# Altium schematic sheet 2_Periph.SchDoc: Peripherals
size A3; SheetNumber: 2
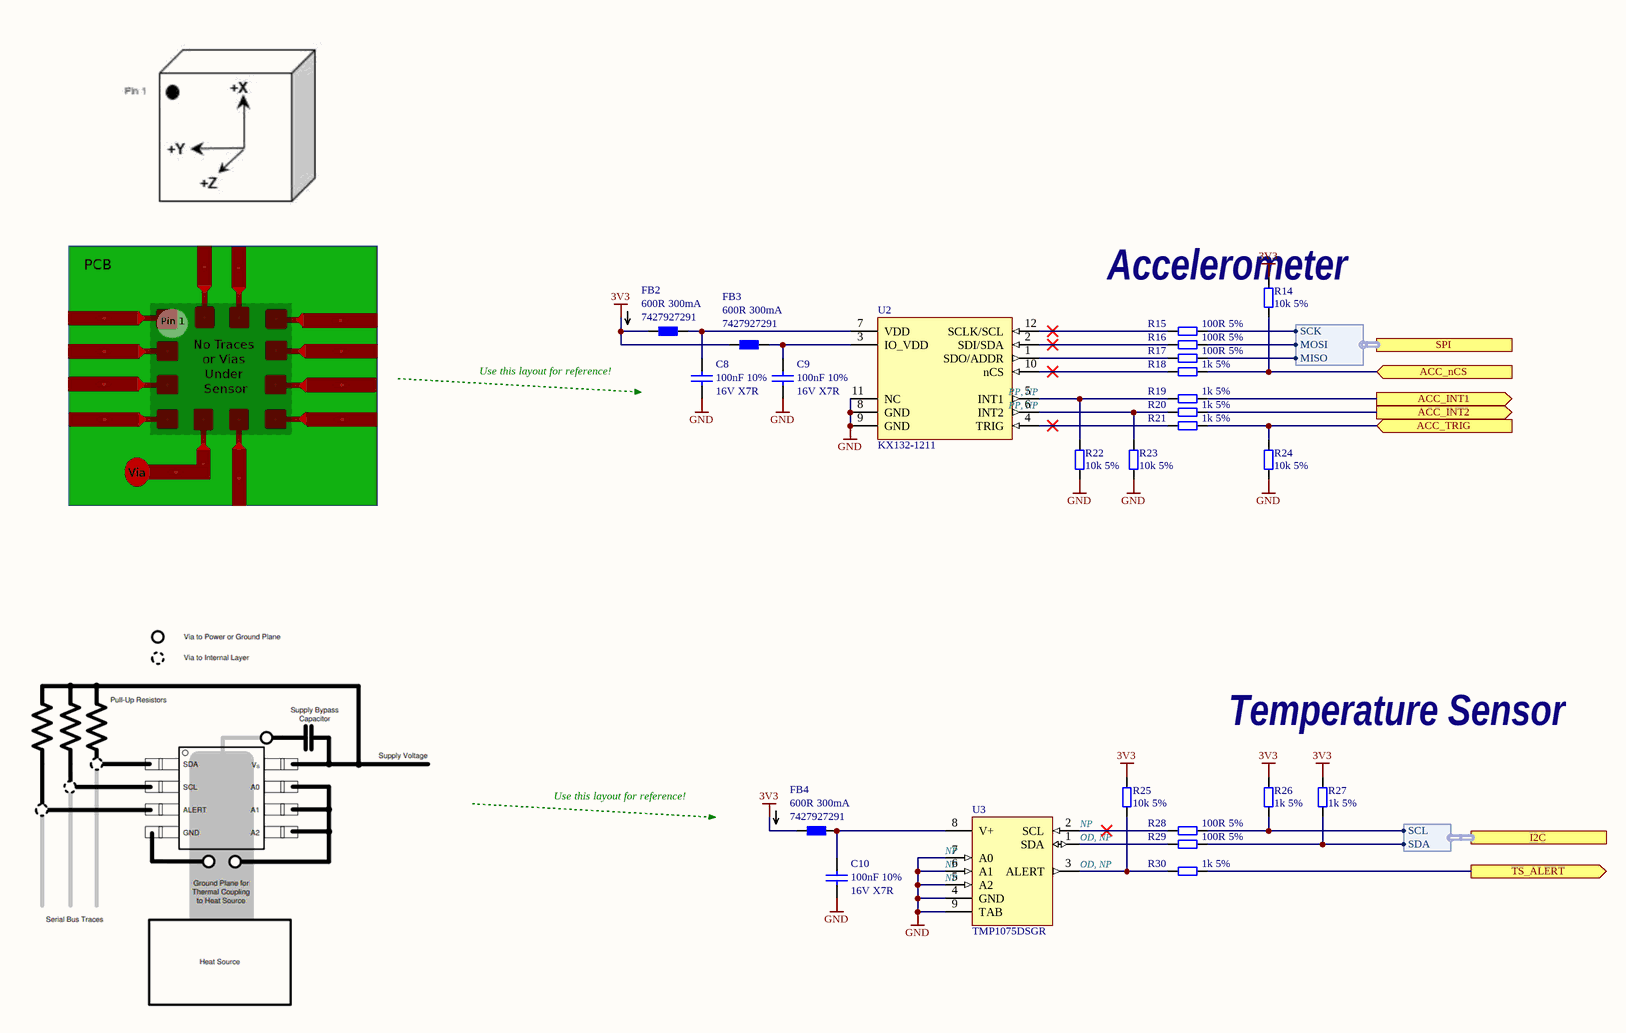
[diagram p0: 2_Periph.SchDoc]

## Parts
C8  Param 2: 16V X7R  Param 1: 100nF 10%  [CAP_0402_L]  (hidden comment: CC0402KRX7R7BB104)
C9  Param 2: 16V X7R  Param 1: 100nF 10%  [CAP_0402_L]  (hidden comment: CC0402KRX7R7BB104)
C10  Param 2: 16V X7R  Param 1: 100nF 10%  [CAP_0402_L]  (hidden comment: CC0402KRX7R7BB104)
FB2  Param 1: 600R 300mA  [BEAD_0402_L]  (hidden comment: 7427927291)
FB3  Param 1: 600R 300mA  [BEAD_0402_L]  (hidden comment: 7427927291)
FB4  Param 1: 600R 300mA  [BEAD_0402_L]  (hidden comment: 7427927291)
R14  Param 1: 10k 5%  [RES_0402_L]  (hidden comment: RC0402JR-0710KL)
R15  Param 1: 100R 5%  [RES_0402_L]  (hidden comment: RC0402JR-07100RL)
R16  Param 1: 100R 5%  [RES_0402_L]  (hidden comment: RC0402JR-07100RL)
R17  Param 1: 100R 5%  [RES_0402_L]  (hidden comment: RC0402JR-07100RL)
R18  Param 1: 1k 5%  [RES_0402_L]  (hidden comment: RC0402JR-071KL)
R19  Param 1: 1k 5%  [RES_0402_L]  (hidden comment: RC0402JR-071KL)
R20  Param 1: 1k 5%  [RES_0402_L]  (hidden comment: RC0402JR-071KL)
R21  Param 1: 1k 5%  [RES_0402_L]  (hidden comment: RC0402JR-071KL)
R22  Param 1: 10k 5%  [RES_0402_L]  (hidden comment: RC0402JR-0710KL)
R23  Param 1: 10k 5%  [RES_0402_L]  (hidden comment: RC0402JR-0710KL)
R24  Param 1: 10k 5%  [RES_0402_L]  (hidden comment: RC0402JR-0710KL)
R25  Param 1: 10k 5%  [RES_0402_L]  (hidden comment: RC0402JR-0710KL)
R26  Param 1: 1k 5%  [RES_0402_L]  (hidden comment: RC0402JR-071KL)
R27  Param 1: 1k 5%  [RES_0402_L]  (hidden comment: RC0402JR-071KL)
R28  Param 1: 100R 5%  [RES_0402_L]  (hidden comment: RC0402JR-07100RL)
R29  Param 1: 100R 5%  [RES_0402_L]  (hidden comment: RC0402JR-07100RL)
R30  Param 1: 1k 5%  [RES_0402_L]  (hidden comment: RC0402JR-071KL)
U2  KX132-1211  [PQFN12P50_200X200]
U3  TMP1075DSGR  [SON9P50_200X200T160X90]

## Ports
ACC_INT1 (out), ACC_INT2 (out), ACC_nCS (in), ACC_TRIG (in), I2C (harness I2C), SPI (harness SPI), TS_ALERT (out)

## Harnesses
SPI: SCK, MOSI, MISO
I2C: SCL, SDA

## Nets
3V3: FB2.2 FB3.2 FB4.2 R14.1 R25.1 R26.1 R27.1
GND: C8.2 C9.2 C10.2 R22.2 R23.2 R24.2 U2.8(GND) U2.9(GND) U2.11(NC) U3.4(GND) U3.5(A2) U3.6(A1) U3.7(A0) U3.9(TAB)
ACC_INT1: R19.2 ; port ACC_INT1
ACC_INT2: R20.2 ; port ACC_INT2
ACC_nCS: R14.2 R18.2 ; port ACC_nCS
ACC_TRIG: R21.2 R24.1 ; port ACC_TRIG
TS_ALERT: R30.2 ; port TS_ALERT
NetC8_1: C8.1 FB2.1 U2.7(VDD)
NetC9_1: C9.1 FB3.1 U2.3(IO_VDD)
NetC10_1: C10.1 FB4.1 U3.8(V+)
NetR15_1: R15.1 U2.12(SCLK/SCL)
NetR15_2: R15.2 ; port SPI.SCK
NetR16_1: R16.1 U2.2(SDI/SDA)
NetR16_2: R16.2 ; port SPI.MOSI
NetR17_1: R17.1 U2.1(SDO/ADDR)
NetR17_2: R17.2 ; port SPI.MISO
NetR18_1: R18.1 U2.10(nCS)
NetR19_1: R19.1 R22.1 U2.5(INT1)
NetR20_1: R20.1 R23.1 U2.6(INT2)
NetR21_1: R21.1 U2.4(TRIG)
NetR25_2: R25.2 R30.1 U3.3(ALERT)
NetR26_2: R26.2 R28.2 ; port I2C.SCL
NetR27_2: R27.2 R29.2 ; port I2C.SDA
NetR28_1: R28.1 U3.2(SCL)
NetR29_1: R29.1 U3.1(SDA)

## Notes on the sheet
- (near U2) Accelerometer
- Use this layout for reference!
- Temperature Sensor
- Title:
- Project:
- Pcb Name:
- Pcb Version:
- Pcb Ident:
- Sheet:
- /
- Bom Name:
- Drawn by:
- Checked by:
- Approved by:
- Bom Version:
- Name:
- Bom Ident:
- Date:
- File:
- (in symbol IC_KX132-1211) PP, NP
- (in symbol IC_TMP1075DSGR) NP; OD, NP

## Library data of the parts
C8-C10 = CAP_0402_100nF_10%_16V_X7R_CC0402KRX7R7BB104: CAP 0402 100nF 10% 16V X7R; Assembly Service Part Choice: Yes; zAlternative 1 - Mfr No 2: /; zAlternative 2 - Mfr No 1: C0402C104K4RACTU; zAlternative 1 - Mfr No 1: 0402YC104KAT2A; zAlternative 4 - Mfr No 1: GRM155R71C104JA88D; Mfr 1: YAGEO; zAlternative 1 - Mfr 1: AVX; zAlternative 2 - Mfr 1: KEMET; zAlternative 4 - Mfr 1: MURATA; Placement: SMD; Auralix WH: WH-ID-016; Temp Max: +125°C; Temp Min: -55°C; Author: GH; Date: 10.8.2020; Assembly Service Provides Material: Yes; sDigikey 1: /; sFarnell 1: /; sMouser 1: /; sDigikey 2: /; sFarnell 2: /; sMouser 2: /; Mfr No 1: CC0402KRX7R7BB104; Mfr No 2: /; zAlternative 2 - Mfr No 2: /; zAlternative 3 - Mfr No 2: /; zAlternative 3 - Mfr No 1: /; zAlternative 4 - Mfr No 2: /; zAlternative 5 - Mfr No 1: /; zAlternative 5 - Mfr No 2: /; zAlternative 6 - Mfr No 1: /; zAlternative 6 - Mfr No 2: /; zAlternative 7 - Mfr No 1: /; zAlternative 7 - Mfr No 2: /; zAlternative 8 - Mfr No 1: /; zAlternative 8 - Mfr No 2: /; zAlternative 9 - Mfr No 1: /; zAlternative 9 - Mfr No 2: /; Mfr 2: /; Mfr 3: /; Mfr No 3: /; sArrow 1: /; sArrow 2: /; sArrow 3: /; sDigikey 3: /; sFarnell 3: /; sMouser 3: /; zAlternative 1 - Mfr 2: /; zAlternative 2 - Mfr 2: /; zAlternative 3 - Mfr 1: /; zAlternative 3 - Mfr 2: /; zAlternative 4 - Mfr 2: /; zAlternative 5 - Mfr 1: /; zAlternative 5 - Mfr 2: /; zAlternative 6 - Mfr 1: /; zAlternative 6 - Mfr 2: /; zAlternative 7 - Mfr 1: /; zAlternative 7 - Mfr 2: /; zAlternative 8 - Mfr 1: /; zAlternative 8 - Mfr 2: /; zAlternative 9 - Mfr 1: /; zAlternative 9 - Mfr 2: /
FB2-FB4 = BEAD_0402_600R_300mA_7427927291: 7427927291 - Ferrite Bead, 0402 [1005 Metric], 600 ohm, 300 mA, WE-CBF Series, 0.6 ohm, ± 25%; Assembly Service Part Choice: No; Mfr 1: WURTH ELECTRONICS; Placement: SMD; Assembly Service Provides Material: Yes; Param 2: /; Temp Max: +125°C; Temp Min: -55°C; Author: TV; Date: 10.7.2018; sDigikey 1: Yes; sMouser 1: Yes; sFarnell 1: Yes; sDigikey 2: /; sFarnell 2: /; sMouser 2: /; Mfr No 2: /; zAlternative 1 - Mfr No 2: /; zAlternative 2 - Mfr No 1: /; zAlternative 1 - Mfr No 1: /; zAlternative 2 - Mfr No 2: /; zAlternative 3 - Mfr No 1: /; zAlternative 3 - Mfr No 2: /; zAlternative 4 - Mfr No 1: /; zAlternative 4 - Mfr No 2: /; zAlternative 5 - Mfr No 1: /; zAlternative 5 - Mfr No 2: /; zAlternative 6 - Mfr No 1: /; zAlternative 6 - Mfr No 2: /; zAlternative 7 - Mfr No 1: /; zAlternative 7 - Mfr No 2: /; zAlternative 8 - Mfr No 1: /; zAlternative 8 - Mfr No 2: /; zAlternative 9 - Mfr No 1: /; zAlternative 9 - Mfr No 2: /; Mfr No 1: 7427927291; Auralix WH: /; Mfr 2: /; Mfr 3: /; Mfr No 3: /; sArrow 1: /; sArrow 2: /; sArrow 3: /; sDigikey 3: /; sFarnell 3: /; sMouser 3: /; zAlternative 1 - Mfr 1: /; zAlternative 1 - Mfr 2: /; zAlternative 2 - Mfr 1: /; zAlternative 2 - Mfr 2: /; zAlternative 3 - Mfr 1: /; zAlternative 3 - Mfr 2: /; zAlternative 4 - Mfr 1: /; zAlternative 4 - Mfr 2: /; zAlternative 5 - Mfr 1: /; zAlternative 5 - Mfr 2: /; zAlternative 6 - Mfr 1: /; zAlternative 6 - Mfr 2: /; zAlternative 7 - Mfr 1: /; zAlternative 7 - Mfr 2: /; zAlternative 8 - Mfr 1: /; zAlternative 8 - Mfr 2: /; zAlternative 9 - Mfr 1: /; zAlternative 9 - Mfr 2: /
R14 R22-R25 = RES_0402_10k_5%_RC0402JR-0710KL: RES 0402 10k 5% 63mW 50V; Assembly Service Part Choice: Yes; zAlternative 1 - Mfr No 2: RC0402FR-1310KL; zAlternative 2 - Mfr No 1: AC0402JR-0710KL; zAlternative 1 - Mfr No 1: RC0402FR-0710KL; zAlternative 2 - Mfr No 2: AC0402JR-1310KL; zAlternative 3 - Mfr No 2: AC0402FR-1310KL; zAlternative 3 - Mfr No 1: AC0402FR-0710KL; zAlternative 4 - Mfr No 1: /; Mfr 1: YAGEO; Placement: SMD; Temp Max: +155°C; Temp Min: -55°C; Author: GH; Date: 10.8.2020; Assembly Service Provides Material: Yes; sDigikey 1: /; sFarnell 1: /; sMouser 1: /; sDigikey 2: /; sFarnell 2: /; sMouser 2: /; Mfr No 2: RC0402JR-1310KL; zAlternative 4 - Mfr No 2: /; zAlternative 5 - Mfr No 1: /; zAlternative 5 - Mfr No 2: /; zAlternative 6 - Mfr No 1: /; zAlternative 6 - Mfr No 2: /; zAlternative 7 - Mfr No 1: /; zAlternative 7 - Mfr No 2: /; zAlternative 8 - Mfr No 1: /; zAlternative 8 - Mfr No 2: /; zAlternative 9 - Mfr No 1: /; zAlternative 9 - Mfr No 2: /; Mfr No 1: RC0402JR-0710KL; Param 2: 63mW 50V; Auralix WH: /; Mfr 2: YAGEO; Mfr 3: /; Mfr No 3: /; sArrow 1: /; sArrow 2: /; sArrow 3: /; sDigikey 3: /; sFarnell 3: /; sMouser 3: /; zAlternative 1 - Mfr 1: YAGEO; zAlternative 1 - Mfr 2: YAGEO; zAlternative 2 - Mfr 1: YAGEO; zAlternative 2 - Mfr 2: YAGEO; zAlternative 3 - Mfr 1: YAGEO; zAlternative 3 - Mfr 2: YAGEO; zAlternative 4 - Mfr 1: /; zAlternative 4 - Mfr 2: /; zAlternative 5 - Mfr 1: /; zAlternative 5 - Mfr 2: /; zAlternative 6 - Mfr 1: /; zAlternative 6 - Mfr 2: /; zAlternative 7 - Mfr 1: /; zAlternative 7 - Mfr 2: /; zAlternative 8 - Mfr 1: /; zAlternative 8 - Mfr 2: /; zAlternative 9 - Mfr 1: /; zAlternative 9 - Mfr 2: /
R15-R17 R28 R29 = RES_0402_100R_5% _RC0402JR-07100RL: RES 0402 100R 5% 63mW 50V; Assembly Service Part Choice: Yes; zAlternative 1 - Mfr No 2: RC0402FR-13100RL; zAlternative 2 - Mfr No 1: AC0402JR-07100RL; zAlternative 1 - Mfr No 1: RC0402FR-07100RL; zAlternative 2 - Mfr No 2: AC0402JR-13100RL; zAlternative 3 - Mfr No 2: AC0402FR-13100RL; zAlternative 3 - Mfr No 1: AC0402FR-07100RL; zAlternative 4 - Mfr No 1: /; Mfr 1: YAGEO; Placement: SMD; Temp Max: +155°C; Temp Min: -55°C; Author: GH; Date: 10.8.2020; Assembly Service Provides Material: Yes; sDigikey 1: /; sFarnell 1: /; sMouser 1: /; sDigikey 2: /; sFarnell 2: /; sMouser 2: /; Mfr No 2: RC0402JR-13100RL; zAlternative 4 - Mfr No 2: /; zAlternative 5 - Mfr No 1: /; zAlternative 5 - Mfr No 2: /; zAlternative 6 - Mfr No 1: /; zAlternative 6 - Mfr No 2: /; zAlternative 7 - Mfr No 1: /; zAlternative 7 - Mfr No 2: /; zAlternative 8 - Mfr No 1: /; zAlternative 8 - Mfr No 2: /; zAlternative 9 - Mfr No 1: /; zAlternative 9 - Mfr No 2: /; Mfr No 1: RC0402JR-07100RL; Param 2: 63mW 50V; Auralix WH: /; Mfr 2: YAGEO; Mfr 3: /; Mfr No 3: /; sArrow 1: /; sArrow 2: /; sArrow 3: /; sDigikey 3: /; sFarnell 3: /; sMouser 3: /; zAlternative 1 - Mfr 1: YAGEO; zAlternative 1 - Mfr 2: YAGEO; zAlternative 2 - Mfr 1: YAGEO; zAlternative 2 - Mfr 2: YAGEO; zAlternative 3 - Mfr 1: YAGEO; zAlternative 3 - Mfr 2: YAGEO; zAlternative 4 - Mfr 1: /; zAlternative 4 - Mfr 2: /; zAlternative 5 - Mfr 1: /; zAlternative 5 - Mfr 2: /; zAlternative 6 - Mfr 1: /; zAlternative 6 - Mfr 2: /; zAlternative 7 - Mfr 1: /; zAlternative 7 - Mfr 2: /; zAlternative 8 - Mfr 1: /; zAlternative 8 - Mfr 2: /; zAlternative 9 - Mfr 1: /; zAlternative 9 - Mfr 2: /
R18-R21 R26 R27 R30 = RES_0402_1k_5%_RC0402JR-071KL: RES 0402 1k 5% 63mW 50V; Assembly Service Part Choice: Yes; zAlternative 1 - Mfr No 2: RC0402FR-131KL; zAlternative 2 - Mfr No 1: AC0402JR-071KL; zAlternative 1 - Mfr No 1: RC0402FR-071KL; zAlternative 2 - Mfr No 2: AC0402JR-131KL; zAlternative 3 - Mfr No 2: AC0402FR-131KL; zAlternative 3 - Mfr No 1: AC0402FR-071KL; zAlternative 4 - Mfr No 1: /; Mfr 1: YAGEO; Placement: SMD; Temp Max: +155°C; Temp Min: -55°C; Author: GH; Date: 10.8.2020; Assembly Service Provides Material: Yes; sDigikey 1: /; sFarnell 1: /; sMouser 1: /; sDigikey 2: /; sFarnell 2: /; sMouser 2: /; Mfr No 2: RC0402JR-131KL; zAlternative 4 - Mfr No 2: /; zAlternative 5 - Mfr No 1: /; zAlternative 5 - Mfr No 2: /; zAlternative 6 - Mfr No 1: /; zAlternative 6 - Mfr No 2: /; zAlternative 7 - Mfr No 1: /; zAlternative 7 - Mfr No 2: /; zAlternative 8 - Mfr No 1: /; zAlternative 8 - Mfr No 2: /; zAlternative 9 - Mfr No 1: /; zAlternative 9 - Mfr No 2: /; Mfr No 1: RC0402JR-071KL; Param 2: 63mW 50V; Auralix WH: /; Mfr 2: YAGEO; Mfr 3: /; Mfr No 3: /; sArrow 1: /; sArrow 2: /; sArrow 3: /; sDigikey 3: /; sFarnell 3: /; sMouser 3: /; zAlternative 1 - Mfr 1: YAGEO; zAlternative 1 - Mfr 2: YAGEO; zAlternative 2 - Mfr 1: YAGEO; zAlternative 2 - Mfr 2: YAGEO; zAlternative 3 - Mfr 1: YAGEO; zAlternative 3 - Mfr 2: YAGEO; zAlternative 4 - Mfr 1: /; zAlternative 4 - Mfr 2: /; zAlternative 5 - Mfr 1: /; zAlternative 5 - Mfr 2: /; zAlternative 6 - Mfr 1: /; zAlternative 6 - Mfr 2: /; zAlternative 7 - Mfr 1: /; zAlternative 7 - Mfr 2: /; zAlternative 8 - Mfr 1: /; zAlternative 8 - Mfr 2: /; zAlternative 9 - Mfr 1: /; zAlternative 9 - Mfr 2: /
U2 = IC_KX132-1211: KX132-1211 -  MEMS Accelerometer, 3-Axis, Digital, X, Y, Z, ± 2g, ± 4g, ± 8g, ± 16g, 1.7 V, 3.6 V, LGA-12; Assembly Service Part Choice: No; Mfr 1: ROHM; Placement: SMD; Assembly Service Provides Material: Yes; Param 1: /; Temp max: +105°C; Temp min: -40°C; Author: GH; Date: 20.11.2020; sDigikey 1: Yes; sFarnell 1: Yes; sMouser 1: Yes; sDigikey 2: /; sFarnell 2: /; sMouser 2: /; Param 2: /; Mfr No 2: /; zAlternative 1 - Mfr No 2: /; zAlternative 2 - Mfr No 1: /; zAlternative 1 - Mfr No 1: /; zAlternative 2 - Mfr No 2: /; zAlternative 3 - Mfr No 1: /; zAlternative 3 - Mfr No 2: /; zAlternative 4 - Mfr No 1: /; zAlternative 4 - Mfr No 2: /; zAlternative 5 - Mfr No 1: /; zAlternative 5 - Mfr No 2: /; zAlternative 6 - Mfr No 1: /; zAlternative 6 - Mfr No 2: /; zAlternative 7 - Mfr No 1: /; zAlternative 7 - Mfr No 2: /; zAlternative 8 - Mfr No 1: /; zAlternative 8 - Mfr No 2: /; zAlternative 9 - Mfr No 1: /; zAlternative 9 - Mfr No 2: /; Auralix WH: /; Mfr No 1: KX132-1211; Mfr 2: /; Mfr 3: /; Mfr No 3: /; sArrow 1: /; sArrow 2: /; sArrow 3: /; sDigikey 3: /; sFarnell 3: /; sMouser 3: /; zAlternative 1 - Mfr 1: /; zAlternative 1 - Mfr 2: /; zAlternative 2 - Mfr 1: /; zAlternative 2 - Mfr 2: /; zAlternative 3 - Mfr 1: /; zAlternative 3 - Mfr 2: /; zAlternative 4 - Mfr 1: /; zAlternative 4 - Mfr 2: /; zAlternative 5 - Mfr 1: /; zAlternative 5 - Mfr 2: /; zAlternative 6 - Mfr 1: /; zAlternative 6 - Mfr 2: /; zAlternative 7 - Mfr 1: /; zAlternative 7 - Mfr 2: /; zAlternative 8 - Mfr 1: /; zAlternative 8 - Mfr 2: /; zAlternative 9 - Mfr 1: /; zAlternative 9 - Mfr 2: /
U3 = IC_TMP1075DSGR: TMP1075DSGR -  Board Mount Temperature Sensor Digital, Local -55°C ~ 125°C 12 b 8-WSON (2x2); Assembly Service Part Choice: No; Mfr 1: TEXAS INSTRUMENTS; Placement: SMD; Assembly Service Provides Material: Yes; Param 1: /; Temp max: +125°C; Temp min: -55°C; Author: GH; Date: 23.11.2020; sDigikey 1: Yes; sFarnell 1: No; sMouser 1: Yes; sDigikey 2: Yes; sFarnell 2: No; sMouser 2: Yes; Param 2: /; Mfr No 2: TMP1075DSGT; zAlternative 1 - Mfr No 2: /; zAlternative 2 - Mfr No 1: /; zAlternative 1 - Mfr No 1: /; zAlternative 2 - Mfr No 2: /; zAlternative 3 - Mfr No 1: /; zAlternative 3 - Mfr No 2: /; zAlternative 4 - Mfr No 1: /; zAlternative 4 - Mfr No 2: /; zAlternative 5 - Mfr No 1: /; zAlternative 5 - Mfr No 2: /; zAlternative 6 - Mfr No 1: /; zAlternative 6 - Mfr No 2: /; zAlternative 7 - Mfr No 1: /; zAlternative 7 - Mfr No 2: /; zAlternative 8 - Mfr No 1: /; zAlternative 8 - Mfr No 2: /; zAlternative 9 - Mfr No 1: /; zAlternative 9 - Mfr No 2: /; Auralix WH: /; Mfr No 1: TMP1075DSGR; Mfr 2: TEXAS INSTRUMENTS; Mfr 3: /; Mfr No 3: /; sArrow 1: /; sArrow 2: /; sArrow 3: /; sDigikey 3: /; sFarnell 3: /; sMouser 3: /; zAlternative 1 - Mfr 1: /; zAlternative 1 - Mfr 2: /; zAlternative 2 - Mfr 1: /; zAlternative 2 - Mfr 2: /; zAlternative 3 - Mfr 1: /; zAlternative 3 - Mfr 2: /; zAlternative 4 - Mfr 1: /; zAlternative 4 - Mfr 2: /; zAlternative 5 - Mfr 1: /; zAlternative 5 - Mfr 2: /; zAlternative 6 - Mfr 1: /; zAlternative 6 - Mfr 2: /; zAlternative 7 - Mfr 1: /; zAlternative 7 - Mfr 2: /; zAlternative 8 - Mfr 1: /; zAlternative 8 - Mfr 2: /; zAlternative 9 - Mfr 1: /; zAlternative 9 - Mfr 2: /